# Altium schematic sheet Li_power.SchDoc
size A4
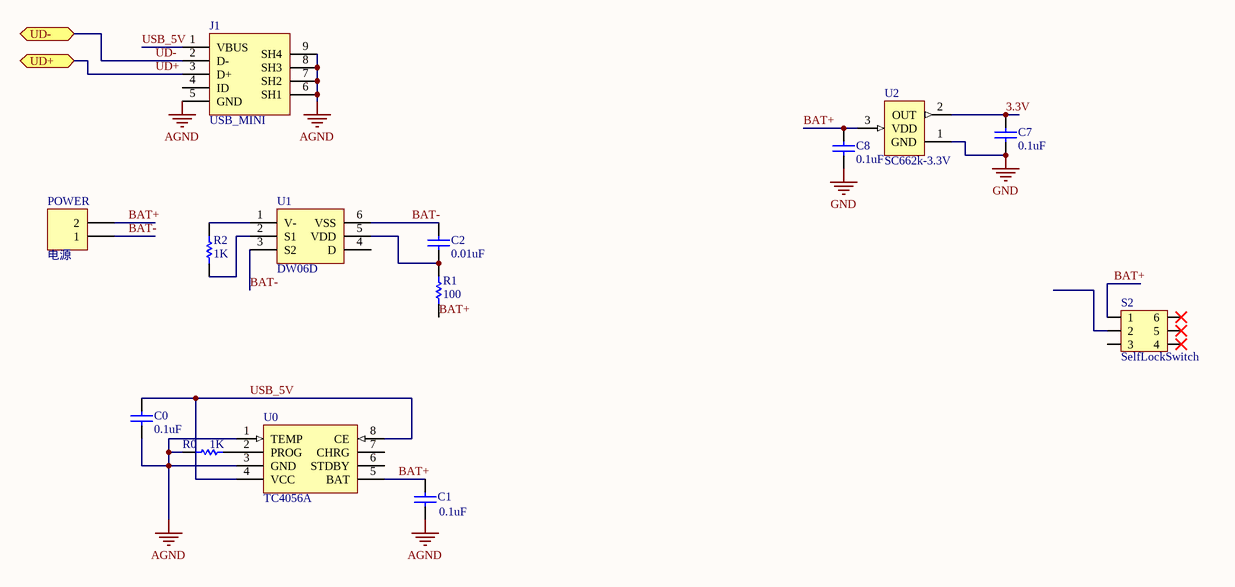
[diagram p0: Li_power.SchDoc]

## Parts
C0  value 0.1uF  [RAD-0.3]  (hidden comment: Cap)
C1  value 0.1uF  [RAD-0.3]  (hidden comment: Cap)
C2  value 0.01uF  [RAD-0.3]  (hidden comment: Cap)
C7  value 0.1uF  [RAD-0.3]  (hidden comment: Cap)
C8  value 0.1uF  [RAD-0.3]  (hidden comment: Cap)
J1  USB_MINI  [MICRO_USB]
POWER  电源  [HDR1X2]
R0  value 1K  [AXIAL-0.3]  (hidden comment: Res1)
R1  value 100  [AXIAL-0.3]  (hidden comment: Res1)
R2  value 1K  [AXIAL-0.3]  (hidden comment: Res1)
S2  SelfLockSwitch  [KEY_ZS_5.8*5.8]
U0  TC4056A  [SOP-8]
U1  DW06D
U2  SC662k-3.3V

## Ports
UD+, UD-

## Nets
AGND: C0.1 C1.1 J1.5(GND) J1.6(SH1) J1.7(SH2) J1.8(SH3) J1.9(SH4) R0.1 U0.1(TEMP) U0.3(GND)
GND: C7.1 C8.2 U2.1(GND)
3.3V: C7.2 U2.2(OUT)
BAT+: C1.2 C8.1 POWER.2 R1.1 S2.1 U0.5(BAT) U2.3(VDD)
BAT-: C2.2 POWER.1 U1.3(S2) U1.6(VSS)
UD+: J1.3(D+) ; port UD+
UD-: J1.2(D-) ; port UD-
USB_5V: C0.2 J1.1(VBUS) U0.4(VCC) U0.8(CE)
NetC2_1: C2.1 R1.2 U1.5(VDD)
NetR0_2: R0.2 U0.2(PROG)
NetR2_1: R2.1 U1.2(S1)
NetR2_2: R2.2 U1.1(V-)

Not connected (* = marked no-connect by the designer): J1 4(ID); S2 2 3 4* 5* 6*; U0 6(STDBY) 7(CHRG); U1 4(D)

## Library data of the parts
C0-C2 C7 C8 = Cap: Capacitor; Published: 8-Jun-2000; LatestRevisionDate: 17-Jul-2002; LatestRevisionNote: Re-released for DXP Platform.; PackageReference: RAD-0.3; Publisher: Altium Limited; PackageDescription: Radial Cap, Thru-Hole; 2 Leads; 0.3 in Pin Spacing
POWER = Header 2: Header, 2-Pin; LatestRevisionDate: 17-Jul-2002; LatestRevisionNote: Re-released for DXP Platform.; Publisher: Altium Limited
R0-R2 = Res1: Resistor; Published: 8-Jun-2000; LatestRevisionDate: 17-Jul-2002; LatestRevisionNote: Re-released for DXP Platform.; PackageReference: AXIAL-0.3; Publisher: Altium Limited; PackageDescription: Axial Device, Thru-Hole; 2 Leads; 0.3 in Pin Spacing
U0 = TC4056A: 锂电池充电
U1 = DW06D: 锂电池保护芯片